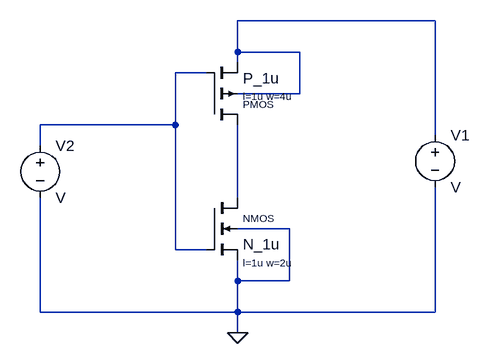
[diagram p0: schematic Draft2.asc]
Draft2.asc, the LTspice schematic file:
Version 4
SHEET 1 880 680
WIRE 512 0 208 0
WIRE 208 48 208 0
WIRE 304 48 208 48
WIRE 208 64 208 48
WIRE 160 80 112 80
WIRE 304 112 304 48
WIRE 304 112 208 112
WIRE 112 160 112 80
WIRE 112 160 -96 160
WIRE 512 176 512 0
WIRE -96 192 -96 160
WIRE 208 272 208 160
WIRE 288 320 208 320
WIRE 112 352 112 160
WIRE 160 352 112 352
WIRE 208 400 208 368
WIRE 288 400 288 320
WIRE 288 400 208 400
WIRE -96 448 -96 272
WIRE 208 448 208 400
WIRE 208 448 -96 448
WIRE 512 448 512 256
WIRE 512 448 208 448
WIRE 208 480 208 448
FLAG 208 480 0
SYMBOL pmos4 160 160 M180
WINDOW 0 56 32 Left 1
WINDOW 123 56 44 Left 1
SYMATTR InstName PMOS
SYMATTR Value P_1u
SYMATTR Value2 l=1u w=4u
SYMBOL nmos4 160 272 R0
WINDOW 0 56 32 Left 1
WINDOW 123 56 100 Left 1
SYMATTR InstName NMOS
SYMATTR Value N_1u
SYMATTR Value2 l=1u w=2u
SYMBOL voltage 512 160 R0
SYMATTR InstName V1
SYMBOL voltage -96 176 R0
SYMATTR InstName V2

The netlist it stands for:
* Draft2.asc
M§PMOS N003 N002 N001 N001 P_1u l=1u w=4u
M§NMOS N003 N002 0 0 N_1u l=1u w=2u
V1 N001 0 V
V2 N002 0 V
.model NMOS NMOS
.model PMOS PMOS
.lib standard.mos
.backanno
.end